# EAGLE design BatteryPowerV2 (EAGLE 9.6.2)
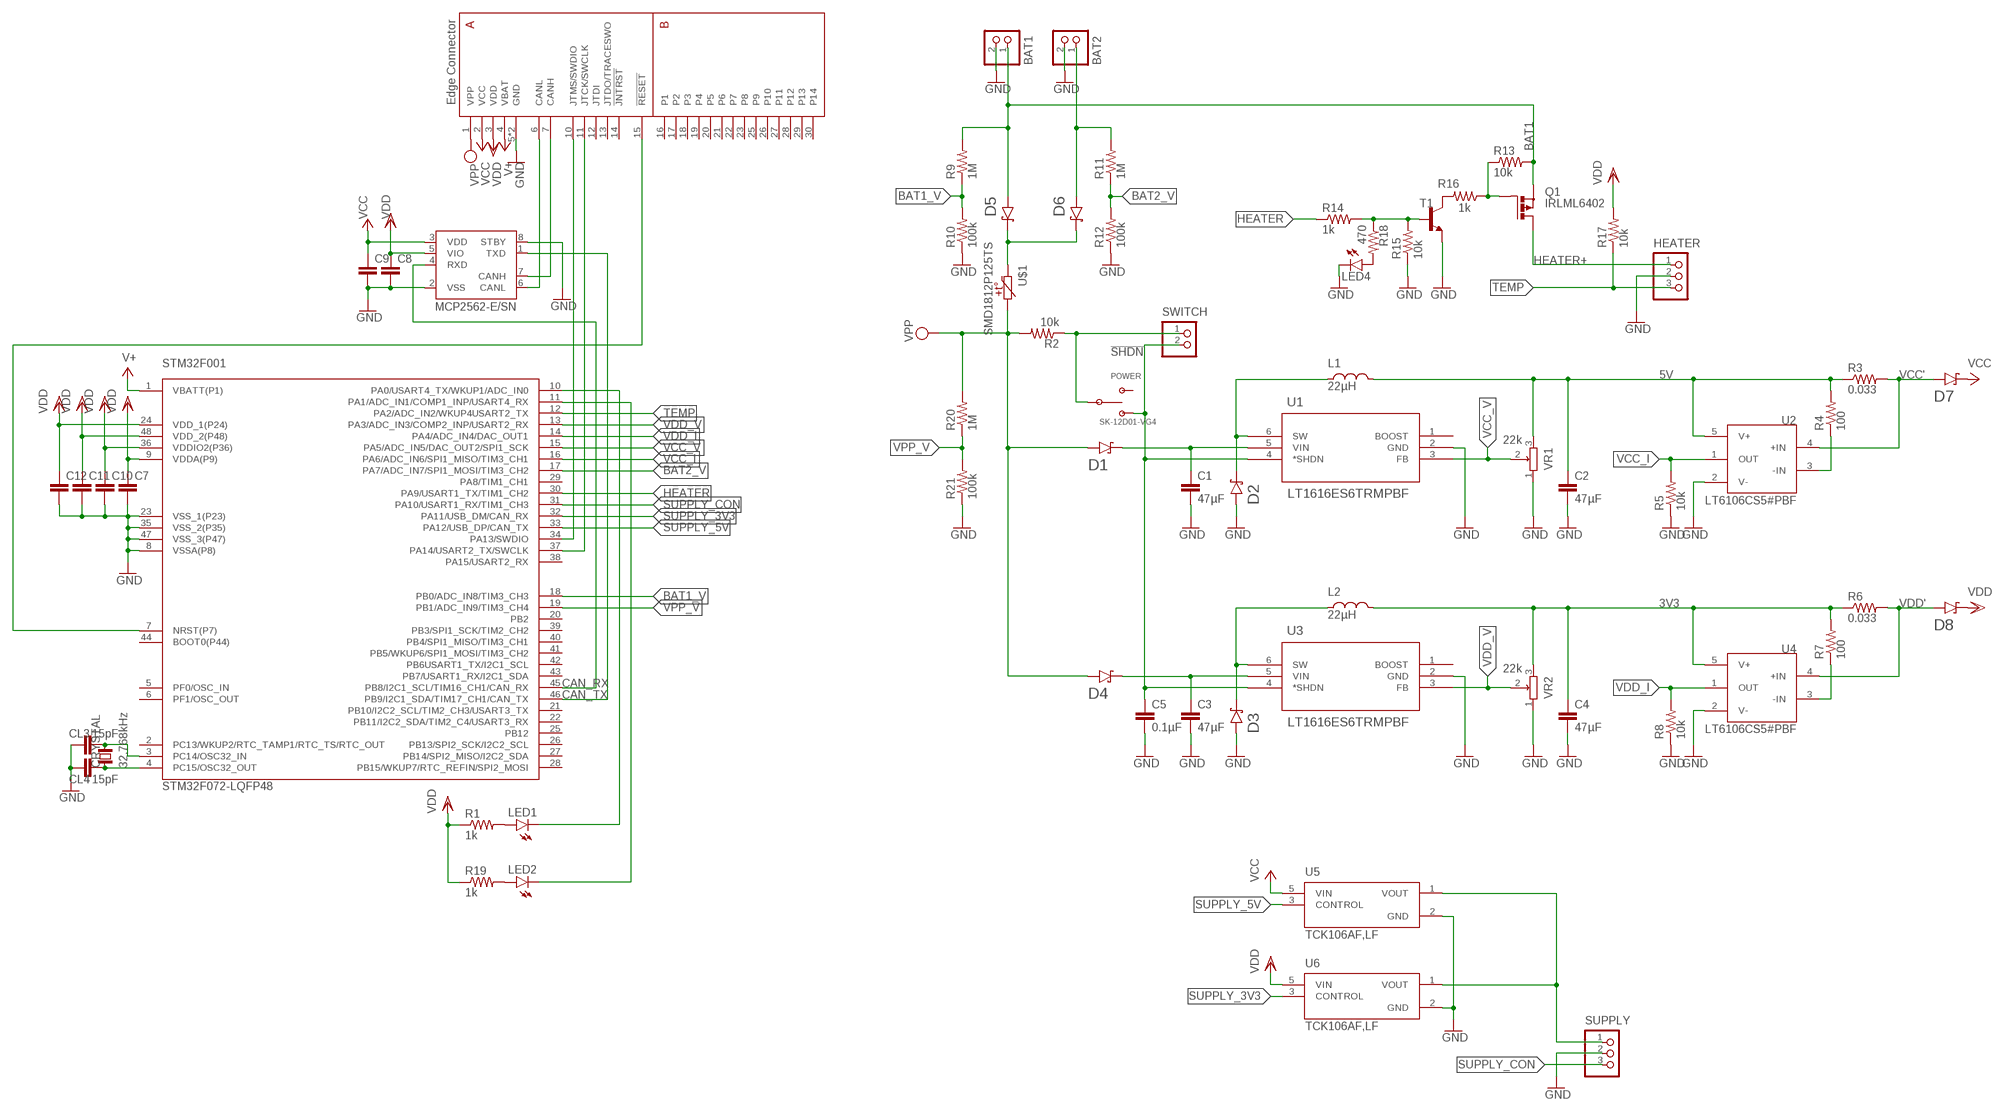
[diagram p0: schematic, sheet 1]

## Parts
BAT1  S2B-XH-A  [S2B-XH-A]
BAT2  S2B-XH-A  [S2B-XH-A]
C1  47µF  C-EUC0603  [C0603]
C2  47µF  C-EUC0603  [C0603]
C3  47µF  C-EUC0603  [C0603]
C4  47µF  C-EUC0603  [C0603]
C5  0.1µF  C-EUC0603  [C0603]
C7  C-EUC0603K  [C0603K]
C8  C-EUC0603K  [C0603K]
C9  C-EUC0603K  [C0603K]
C10  C-EUC0603K  [C0603K]
C11  C-EUC0603K  [C0603K]
C12  C-EUC0603K  [C0603K]
CL3  15pF  C-EUC0603K  [C0603K]
CL4  15pF  C-EUC0603K  [C0603K]
CRYSTAL  32.768kHz  CRYTALFC-255  [FC-255]
D1  CUHS20S30  [CUHS20S30]
D2  CUHS20S30  [CUHS20S30]
D3  CUHS20S30  [CUHS20S30]
D4  CUHS20S30  [CUHS20S30]
D5  CUHS20S30  [CUHS20S30]
D6  CUHS20S30  [CUHS20S30]
D7  CUHS20S30  [CUHS20S30]
D8  CUHS20S30  [CUHS20S30]
HEATER  S3B-PH-K-S  [S3B-PH-K-S]
L1  22µH  NR10050  [NR10050]
L2  22µH  NR10050  [NR10050]
LED1  LEDCHIP-LED0603  [CHIP-LED0603]
LED2  LEDCHIP-LED0603  [CHIP-LED0603]
LED4  LEDCHIPLED_0603  [CHIPLED_0603]
MCP2562  MCP2562-E/SN  [SOIC127P600X175-8N]
POWER  SK-12D01-VG4  [SK-12D01-VG4]
Q1  IRLML6402  [SOT-23]
R1  1k  R-US_R0603  [R0603]
R2  10k  R-US_R0603  [R0603]
R3  0.033  R-US_R0603  [R0603]
R4  100  R-US_R0603  [R0603]
R5  10k  R-US_R0603  [R0603]
R6  0.033  R-US_R0603  [R0603]
R7  100  R-US_R0603  [R0603]
R8  10k  R-US_R0603  [R0603]
R9  1M  R-US_R0603  [R0603]
R10  100k  R-US_R0603  [R0603]
R11  1M  R-US_R0603  [R0603]
R12  100k  R-US_R0603  [R0603]
R13  10k  R-US_R0603  [R0603]
R14  1k  R-US_R0603  [R0603]
R15  10k  R-US_R0603  [R0603]
R16  1k  R-US_R0603  [R0603]
R17  10k  R-US_R0603  [R0603]
R18  470  R-US_R0603  [R0603]
R19  1k  R-US_R0603  [R0603]
R20  1M  R-US_R0603  [R0603]
R21  100k  R-US_R0603  [R0603]
STM32F001  STM32F072-LQFP48  [LQFP48]
SUPPLY  S3B-PH-K-S  [S3B-PH-K-S]
SWITCH  S2B-PH-K-S  [S2B-PH-K-S]
T1  -NPN-SOT23-EBC  [SOT23-EBC]
U1  LT1616ES6TRMPBF  [SOT-6_S]
U2  LT6106CS5#PBF  [SOT95P280X100-5N_LT6106CS5#PBF]
U3  LT1616ES6TRMPBF  [SOT-6_S]
U4  LT6106CS5#PBF  [SOT95P280X100-5N_LT6106CS5#PBF]
U5  TCK106AF,LF  [IC_TCK106AF,LF]
U6  TCK106AF,LF  [IC_TCK106AF,LF]
U$1  SMD1812P125TS  [SMD1812P]
U$2  EDGE30  [EDGE30]
VR1  22k  PVZ3A  [PVZ3A]
VR2  22k  PVZ3A  [PVZ3A]

## Nets
3V3: C4.1 L2.2 R6.1 R7.2 U4.5(V+) VR2.3
5V: C2.1 L1.2 R3.1 R4.2 U2.5(V+) VR1.3
!SHDN!: C5.1 POWER.B SWITCH.2 U1.4(*SHDN) U3.4(*SHDN)
BAT1: BAT1.1 D5.A Q1.P2(S) R9.2 R13.2
BAT1_V: R9.1 R10.2 STM32F001.18(PB0/ADC_IN8/TIM3_CH3)
BAT2: BAT2.1 D6.A R11.2
BAT2_V: R11.1 R12.2 STM32F001.17(PA7/ADC_IN7/SPI1_MOSI/TIM3_CH2)
CAN_RX: MCP2562.4(RXD) STM32F001.45(PB8/I2C1_SCL/TIM16_CH1/CAN_RX)
CAN_TX: MCP2562.1(TXD) STM32F001.46(PB9/I2C1_SDA/TIM17_CH1/CAN_TX)
CANH1: MCP2562.7(CANH) U$2.7(CANH)
CANL1: MCP2562.6(CANL) U$2.6(CANL)
GND: BAT1.2 BAT2.2 C1.2 C2.2 C3.2 C4.2 C5.2 C7.2 C8.2 C9.2 C10.2 C11.2 C12.2 CL3.1 CL4.1 D2.A D3.A HEATER.2 LED4.C MCP2562.2(VSS) MCP2562.8(STBY) R5.1 R8.1 R10.1 R12.1 R15.1 R21.1 STM32F001.8(VSSA(P8)) STM32F001.23(VSS_1(P23)) STM32F001.35(VSS_2(P35)) STM32F001.47(VSS_3(P47)) SUPPLY.2 T1.E U1.2(GND) U2.2(V-) U3.2(GND) U4.2(V-) U5.2(GND) U6.2(GND) U$2.5(GND) U$2.8(GND) VR1.1 VR2.1
HEATER: R14.1 STM32F001.30(PA9/USART1_TX/TIM1_CH2)
HEATER+: HEATER.1 Q1.P3(D)
N$1: SUPPLY.1 U5.1(VOUT) U6.1(VOUT)
N$2: R4.1 U2.3(-IN)
N$3: Q1.P1(G) R13.1 R16.1
N$5: LED2.C STM32F001.11(PA1/ADC_IN1/COMP1_INP/USART4_RX)
N$6: R7.1 U4.3(-IN)
N$7: POWER.C R2.1 SWITCH.1
N$9: LED2.A R19.2
N$10: R14.2 R15.2 R18.1 T1.B
N$11: R16.2 T1.C
N$13: LED4.A R18.2
N$71: CL4.2 CRYSTAL.1 STM32F001.4(PC15/OSC32_OUT)
N$72: CL3.2 CRYSTAL.2 STM32F001.3(PC14/OSC32_IN)
N$73: LED1.C STM32F001.10(PA0/USART4_TX/WKUP1/ADC_IN0)
N$76: LED1.A R1.2
NRST1: STM32F001.7(NRST(P7)) U$2.15(!RESET!)
SUPPLY_3V3: STM32F001.32(PA11/USB_DM/CAN_RX) U6.3(CONTROL)
SUPPLY_5V: STM32F001.33(PA12/USB_DP/CAN_TX) U5.3(CONTROL)
SUPPLY_CON: STM32F001.31(PA10/USART1_RX/TIM1_CH3) SUPPLY.3
SWCLK1: STM32F001.37(PA14/USART2_TX/SWCLK) U$2.11(JTCK/SWCLK)
SWDIO1: STM32F001.34(PA13/SWDIO) U$2.10(JTMS/SWDIO)
TEMP: HEATER.3 R17.1 STM32F001.12(PA2/ADC_IN2/WKUP4USART2_TX)
VBAT: STM32F001.1(VBATT(P1)) U$2.4(VBAT) ; supply symbol labelled V+
VCC: C9.1 D7.C MCP2562.3(VDD) U5.5(VIN) U$2.2(VCC)
VCC': D7.A R3.2 U2.4(+IN)
VCC_I: R5.2 STM32F001.16(PA6/ADC_IN6/SPI1_MISO/TIM3_CH1) U2.1(OUT)
VCC_IN: C1.1 D1.C U1.5(VIN)
VCC_SW: D2.C L1.1 U1.6(SW)
VCC_V: STM32F001.15(PA5/ADC_IN5/DAC_OUT2/SPI1_SCK) U1.3(FB) VR1.2
VDD: C7.1 C8.1 C10.1 C11.1 C12.1 D8.C MCP2562.5(VIO) R1.1 R17.2 R19.1 STM32F001.9(VDDA(P9)) STM32F001.24(VDD_1(P24)) STM32F001.36(VDDIO2(P36)) STM32F001.48(VDD_2(P48)) U6.5(VIN) U$2.3(VDD)
VDD': D8.A R6.2 U4.4(+IN)
VDD_I: R8.2 STM32F001.14(PA4/ADC_IN4/DAC_OUT1) U4.1(OUT)
VDD_IN: C3.1 D4.C U3.5(VIN)
VDD_SW: D3.C L2.1 U3.6(SW)
VDD_V: STM32F001.13(PA3/ADC_IN3/COMP2_INP/USART2_RX) U3.3(FB) VR2.2
VPP: D1.A D4.A R2.2 R20.2 U$1.2 U$2.1(VPP)
VPP_IN: D5.C D6.C U$1.1
VPP_V: R20.1 R21.2 STM32F001.19(PB1/ADC_IN9/TIM3_CH4)
Unconnected: POWER.A STM32F001.2(PC13/WKUP2/RTC_TAMP1/RTC_TS/RTC_OUT) STM32F001.5(PF0/OSC_IN) STM32F001.6(PF1/OSC_OUT) STM32F001.20(PB2) STM32F001.21(PB10/I2C2_SCL/TIM2_CH3/USART3_TX) STM32F001.22(PB11/I2C2_SDA/TIM2_C4/USART3_RX) STM32F001.25(PB12) STM32F001.26(PB13/SPI2_SCK/I2C2_SCL) STM32F001.27(PB14/SPI2_MISO/I2C2_SDA) STM32F001.28(PB15/WKUP7/RTC_REFIN/SPI2_MOSI) STM32F001.29(PA8/TIM1_CH1) STM32F001.38(PA15/USART2_RX) STM32F001.39(PB3/SPI1_SCK/TIM2_CH2) STM32F001.40(PB4/SPI1_MISO/TIM3_CH1) STM32F001.41(PB5/WKUP6/SPI1_MOSI/TIM3_CH2) STM32F001.42(PB6USART1_TX/I2C1_SCL) STM32F001.43(PB7/USART1_RX/I2C1_SDA) STM32F001.44(BOOT0(P44)) U1.1(BOOST) U3.1(BOOST) U$2.12(JTDI) U$2.13(JTDO/TRACESWO) U$2.14(!JNTRST!) U$2.16(P1) U$2.17(P2) U$2.18(P3) U$2.19(P4) U$2.20(P5) U$2.21(P6) U$2.22(P7) U$2.23(P8) U$2.25(P9) U$2.26(P10) U$2.27(P11) U$2.28(P12) U$2.29(P13) U$2.30(P14)

## Library data of the parts
BAT1 BAT2 = con-jst-xh:S2B-XH-A: Wire-to-Board 2.5mm pitch side mount connector Source: http://www.jst-mfg.com/product/pdf/jpn/XH.pdf http://www.jst-mfg.com/product/detail.php?series=277
C1-C5 C7-C12 CL3 CL4 = rcl:C-EU: CAPACITOR, European symbol; SPICEPREFIX: C
CRYSTAL = crystal':CRYTAL: CRYSTAL
D1-D8 = diodes:CUHS20S30
HEATER SUPPLY = jst-ph:S3B-PH-*: Wire-to-Board 2.0mm pitch side mount connector Source: http://www.jst-mfg.com/product/pdf/jpn/PH.pdf http://www.jst-mfg.com/product/detail.php?series=199
L1 L2 = inductors:NR10050
LED1 LED2 LED4 = led:LED: LED OSRAM: - CHIPLED LG R971, LG N971, LY N971, LG Q971, LY Q971, LO R971, LY R971 LH N974, LH R974 LS Q976, LO Q976, LY Q976 LO Q996 - Hyper CHIPLED LW Q18S LB Q993, LB Q99A, LB R99A - SideLED LS A670, LO A670, LY A670, LG A670, LP A670 LB A673, LV A673, LT A673, LW A673 LH A674 LY A675 LS A676, LA A676, LO A676, LY A676, LW A676 LS A679, LY A679, LG A679 - Hyper Micro SIDELED® LS Y876, LA Y876, LO Y876, LY Y876 LT Y87S - SmartLED LW L88C, LW L88S LB L89C, LB L89S, LG L890 LS L89K, LO L89K, LY L89K LS L896, LA L896, LO L896, LY L896 - TOPLED LS T670, LO T670, LY T670, LG T670, LP T670 LSG T670, LSP T670, LSY T670, LOP T670, LYG T670 LG T671, LOG T671, LSG T671 LB T673, LV T673, LT T673, LW T673 LH T674 LS T676, LA T676, LO T676, LY T676, LB T676, LH T676, LSB T676, LW T676 LB T67C, LV T67C, LT T67C, LS T67K, LO T67K, LY T67K, LW E67C LS E67B, LA E67B, LO E67B, LY E67B, LB E67C, LV E67C, LT E67C LW T67C LS T679, LY T679, LG T679 LS T770, LO T770, LY T770, LG T770, LP T770 LB T773, LV T773, LT T773, LW T773 LH T774 LS E675, LA E675, LY E675, LS T675 LS T776, LA T776, LO T776, LY T776, LB T776 LHGB T686 LT T68C, LB T68C - Hyper Mini TOPLED® LB M676 - Mini TOPLED Santana® LG M470 LS M47K, LO M47K, LY M47K Source: http://www.osram.convergy.de LUXEON: - LUMILED® LXK2-PW12-R00, LXK2-PW12-S00, LXK2-PW14-U00, LXK2-PW14-V00 LXK2-PM12-R00, LXK2-PM12-S00, LXK2-PM14-U00 LXK2-PE12-Q00, LXK2-PE12-R00, LXK2-PE12-S00, LXK2-PE14-T00, LXK2-PE14-U00 LXK2-PB12-K00, LXK2-PB12-L00, LXK2-PB12-M00, LXK2-PB14-N00, LXK2-PB14-P00, LXK2-PB14-Q00 LXK2-PR12-L00, LXK2-PR12-M00, LXK2-PR14-Q00, LXK2-PR14-R00 LXK2-PD12-Q00, LXK2-PD12-R00, LXK2-PD12-S00 LXK2-PH12-R00, LXK2-PH12-S00 LXK2-PL12-P00, LXK2-PL12-Q00, LXK2-PL12-R00 Source: www.luxeon.com KINGBRIGHT: KA-3528ASYC Source: www.kingbright.com
MCP2562 = mcp2562-E_SN:MCP2562-E/SN: MCP2562 Series 5 V Surface Mount High-Speed CAN Transceiver - SOIC-8; AVAILABILITY: Unavailable; DESCRIPTION: Microchip MCP2562-E/SN, CAN Transceiver 1MBps 1-channel IEC 61000-4-2, 8-Pin SOIC; MF: Microchip; MP: MCP2562-E/SN; PACKAGE: SO-8 Microchip; PRICE: None
POWER = switches:SK-12D01-VG4
Q1 = mosfet:IRLML6402: Pch MOSFET IRLML6402 20V 3.7A http://akizukidenshi.com/catalog/g/gI-02553/ I-02553
R1-R21 = rcl:R-US_: RESISTOR, American symbol; SPICEPREFIX: R
STM32F001 = stm32f0:STM32F072
SWITCH = jst-ph:S2B-PH-*: Wire-to-Board 2.0mm pitch side mount connector Source: http://www.jst-mfg.com/product/pdf/jpn/PH.pdf http://www.jst-mfg.com/product/detail.php?series=199
T1 = transistor:*-NPN-: NPN Transistror BF959 corrected 2008.03.06
U1 U3 = LT1616ES6TRMPBF:LT1616ES6TRMPBF: Check availability <https://pricing.snapeda.com/parts/LT1616ES6%23TRMPBF/Analog%20Devices/view-part?ref=eda>; AVAILABILITY: In Stock; DESCRIPTION: 600mA, 1.4MHz Step-Down Switching Regulator in SOT-23; MF: Analog Devices; MP: LT1616ES6#TRMPBF; PACKAGE: SOT-6 Analog Devices; PRICE: None; PURCHASE-URL: https://pricing.snapeda.com/search/part/LT1616ES6#TRMPBF/?ref=eda
U2 U4 = LT6106CS5_PBF:LT6106CS5#PBF: IC OPAMP CURR SENSE TSOT23-5 Check availability <https://pricing.snapeda.com/parts/LT6106CS5%23PBF/Linear%20Technology/view-part?ref=eda>; AVAILABILITY: Not in stock; DESCRIPTION: LT6106 - Low Cost, 36V High Side Current Sense Amplifier; MF: Linear Technology; MP: LT6106CS5#PBF; PACKAGE: TSOT-23 Linear Technology; PRICE: None
U5 U6 = TCK106AF_LF:TCK106AF,LF: Power Switch/Driver 1:1 P-Channel 1A 5-SMV, SOT-25, SC-74A Check availability <https://pricing.snapeda.com/parts/TCK106AF%2CLF/Toshiba%20Semiconductor/view-part?ref=eda>; AVAILABILITY: In Stock; DESCRIPTION: Power Switch/Driver 1:1 P-Channel 1A 5-SMV, SOT-25, SC-74A; MF: Toshiba Semiconductor; MP: TCK106AF,LF; PACKAGE: SOT-753 Toshiba Semiconductor; PRICE: None; PURCHASE-URL: https://pricing.snapeda.com/search/part/TCK106AF,LF/?ref=eda
U$1 = ptc:SMD1812P125TS
U$2 = bus:EDGE30
VR1 VR2 = potentiometers:PVZ3A

## Net classes
0 default: width 0.254 mm, drill 0.152 mm, clearance 0.127 mm

## Board
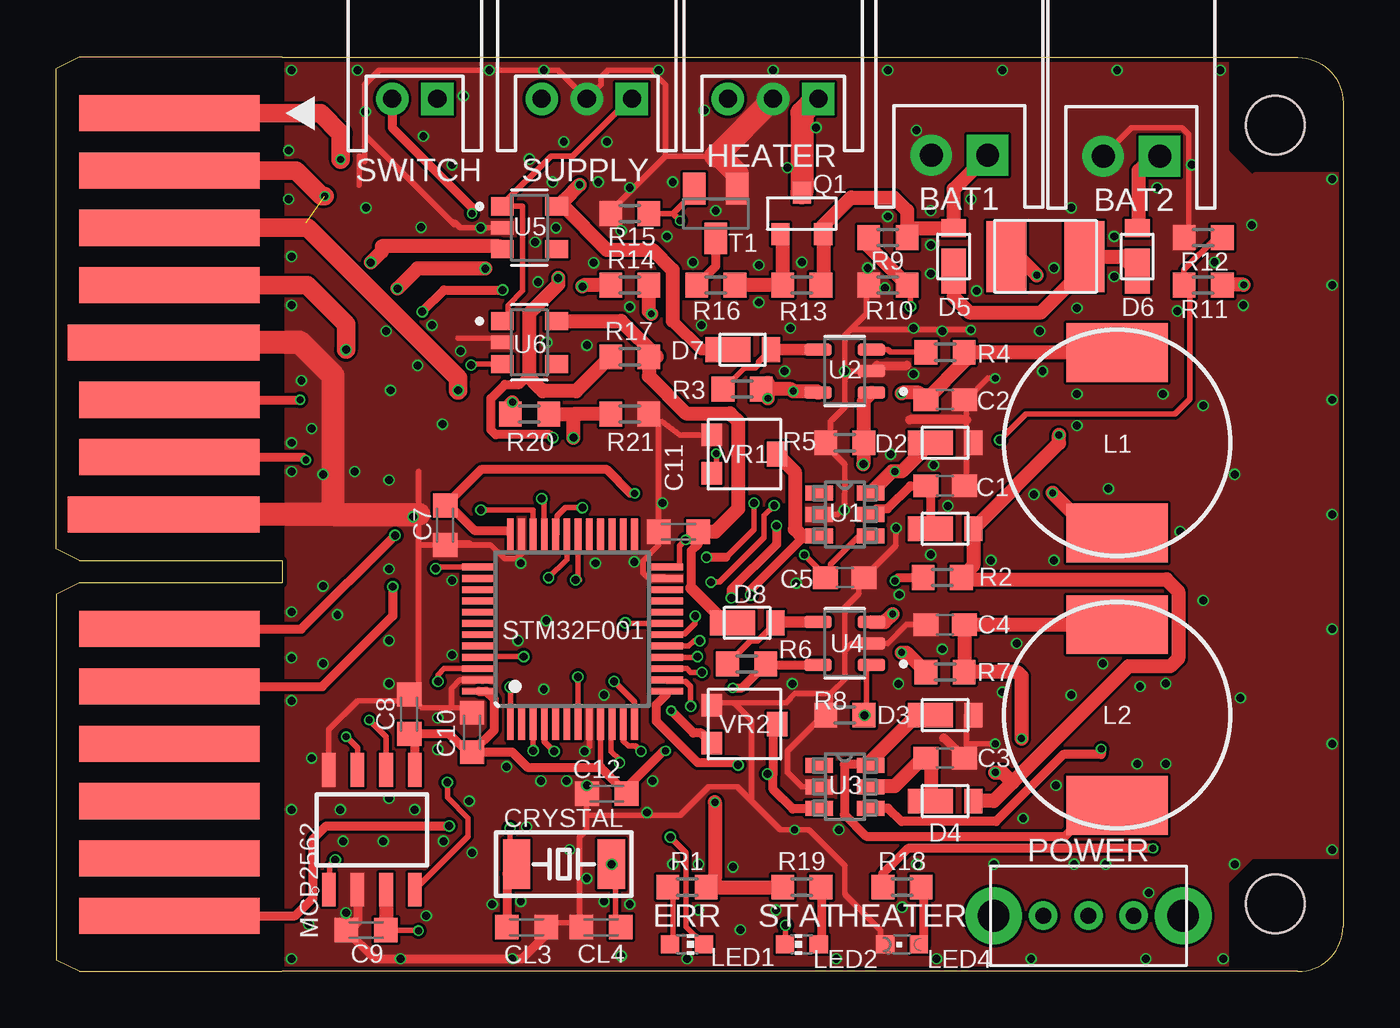
[diagram p1: board, top side]
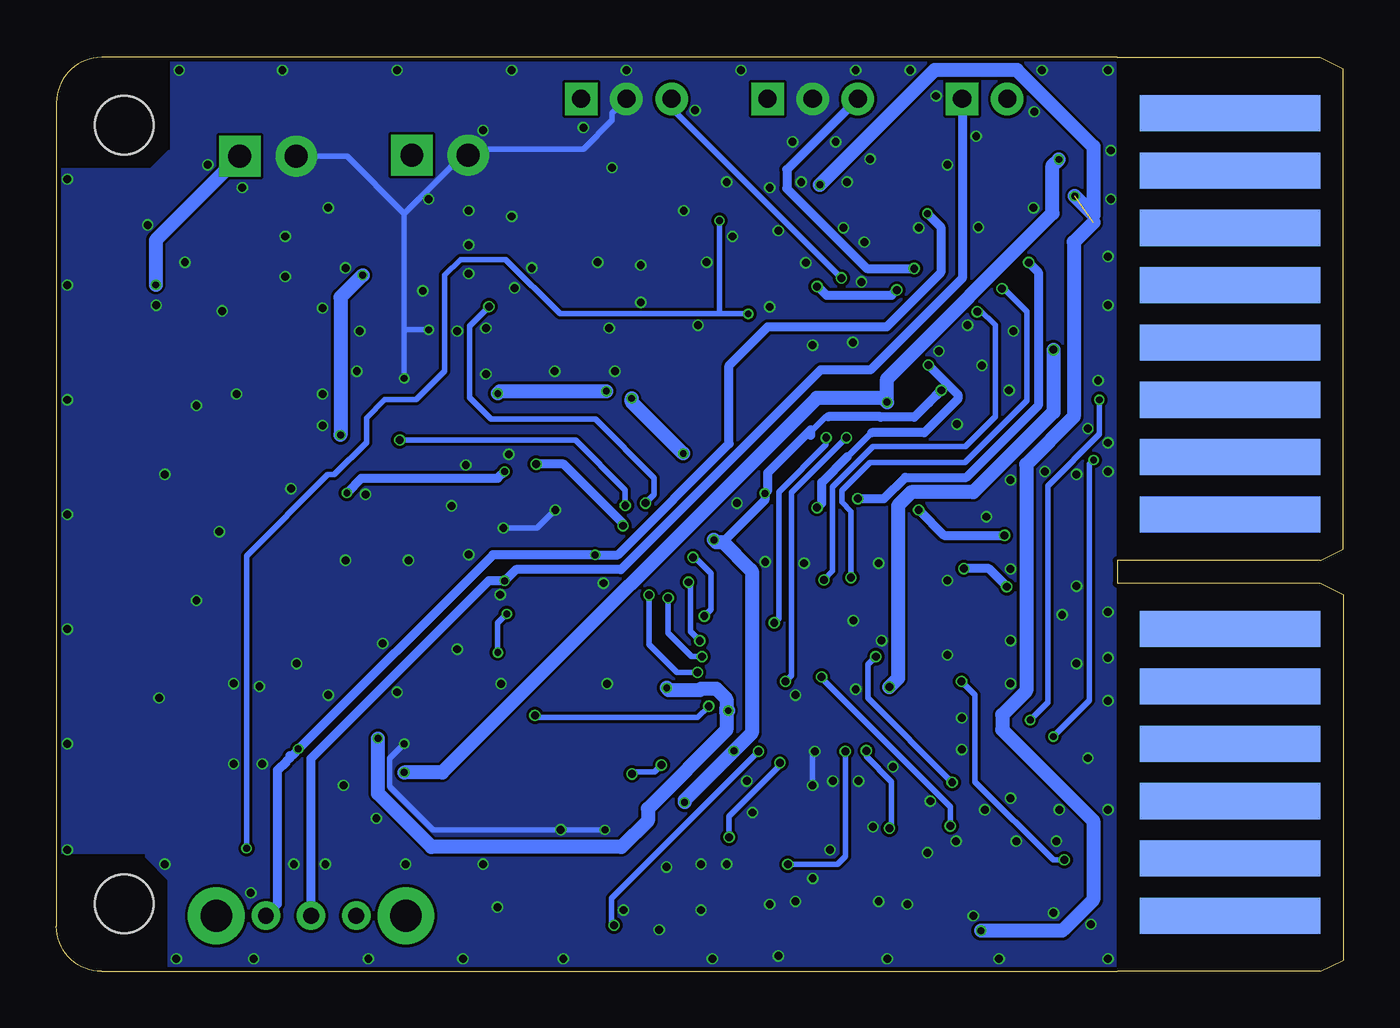
[diagram p2: board, bottom side, seen from below]

Size 57 x 40.5 mm. Coordinates in mm from the lower left corner, seen from the top.
Outline: 10,40.5 55,40.5 arc-90 57,38.5 57,2 arc-90 55,0 10,0
Copper layers (1*16): Top 0.035mm / dielectric 1.6mm / Bottom 0.035mm
Design rules "jlcpcb-2layers_": minimum track width 5mil, minimum drill 0.3mm, track to track 5mil, track to pad 5mil, pad to pad 5mil, via to via 5mil, smd to smd 5mil, copper to edge 0.2mm, drill to drill 6mil, minimum pad ring 10mil, minimum via ring 3mil, stop-mask expansion 4mil, vias tented up to drill 100mil, thermal gap 10mil
Holes 2.6 mm at 54,3 54,37.5

### Footprints (pad centres in the part's own frame; a part is rotated, then mirrored left to right if it is on the bottom)
S2B-XH-A = drill 1.016 square: 1 1.25,0 | drill 1.016: 2 -1.25,0
C0603 = smd 1.1 x 1: 1 -0.85,0; 2 0.85,0
C0603K = smd 1.05 x 1.08: 1 -0.875,0; 2 0.875,0
FC-255 = smd 1.2 x 2.2: 1 -2.1,0; 2 2.1,0
CUHS20S30 = smd 0.8 x 1.1: A 1.25,0 | smd 2 x 1.1: C -0.65,0
S3B-PH-K-S = drill 0.8 square: 1 2,0 | drill 0.8: 2 0,0; 3 -2,0
NR10050 = smd 2.6 x 4.5: 1 -4,0; 2 4,0
CHIP-LED0603 = smd 0.8 x 0.8: A 0,-0.75; C 0,0.75
CHIPLED_0603 = smd 0.8 x 0.8: A 0,-0.75; C 0,0.75
SOIC127P600X175-8N = smd 1.5 x 0.6: 1 -2.65,1.905; 2 -2.65,0.635; 3 -2.65,-0.635; 4 -2.65,-1.905; 5 2.65,-1.905; 6 2.65,-0.635; 7 2.65,0.635; 8 2.65,1.905
SK-12D01-VG4 = drill 1.4 pad 1.93: 1 -4.2,0; 2 4.2,0 | drill 0.7: A -2,0; B 2,0; C 0,0
SOT-23 = smd 0.802 x 0.972: P1 -0.95,-0.917; P2 0.95,-0.917; P3 0,0.917
R0603 = smd 1 x 1.1: 1 -0.85,0; 2 0.85,0
LQFP48 = smd 1.5 x 0.3: 1 -4.15,2.75; 2 -4.15,2.25; 3 -4.15,1.75; 4 -4.15,1.25; 5 -4.15,0.75; 6 -4.15,0.25; 7 -4.15,-0.25; 8 -4.15,-0.75; 9 -4.15,-1.25; 10 -4.15,-1.75; 11 -4.15,-2.25; 12 -4.15,-2.75; 25 4.15,-2.75; 26 4.15,-2.25; 27 4.15,-1.75; 28 4.15,-1.25; 29 4.15,-0.75; 30 4.15,-0.25; 31 4.15,0.25; 32 4.15,0.75; 33 4.15,1.25; 34 4.15,1.75; 35 4.15,2.25; 36 4.15,2.75 | smd 0.3 x 1.5: 13 -2.75,-4.15; 14 -2.25,-4.15; 15 -1.75,-4.15; 16 -1.25,-4.15; 17 -0.75,-4.15; 18 -0.25,-4.15; 19 0.25,-4.15; 20 0.75,-4.15; 21 1.25,-4.15; 22 1.75,-4.15; 23 2.25,-4.15; 24 2.75,-4.15; 37 2.75,4.15; 38 2.25,4.15; 39 1.75,4.15; 40 1.25,4.15; 41 0.75,4.15; 42 0.25,4.15; 43 -0.25,4.15; 44 -0.75,4.15; 45 -1.25,4.15; 46 -1.75,4.15; 47 -2.25,4.15; 48 -2.75,4.15
S2B-PH-K-S = drill 0.8 square: 1 1,0 | drill 0.8: 2 -1,0
SOT23-EBC = smd 1 x 1.4: B 0.95,-1.1; C 0,1.1; E -0.95,-1.1
SOT-6_S = smd 1.219 x 0.66: 1 -1.143,0.95; 2 -1.143,0; 3 -1.143,-0.95; 4 1.143,-0.95; 5 1.143,0; 6 1.143,0.95
SOT95P280X100-5N_LT6106CS5#PBF = smd 1.24 x 0.55: 1 -1.185,0.95; 2 -1.185,0; 3 -1.185,-0.95; 4 1.185,-0.95; 5 1.185,0.95
IC_TCK106AF,LF = smd 1 x 0.8: 1 -1.2,0.95; 3 -1.2,-0.95; 4 1.2,-0.95; 5 1.2,0.95 | smd 1 x 0.6: 2 -1.2,0
SMD1812P = smd 1.78 x 3.15: 1 -1.725,0; 2 1.725,0
EDGE30 = smd 1.6 x 8: 1 -17.78,-5; 2 -15.24,-5; 3 -12.7,-5; 4 -10.16,-5; 6 -5.08,-5; 7 -2.54,-5; 10 5.08,-5; 11 7.62,-5; 12 10.16,-5; 13 12.7,-5; 14 15.24,-5; 15 17.78,-5 | smd 1.6 x 8.5: 5 -7.62,-5.25; 8 0,-5.25 | smd 1.6 x 8 bottom: 16 -17.78,-5; 17 -15.24,-5; 18 -12.7,-5; 19 -10.16,-5; 20 -7.62,-5; 21 -5.08,-5; 22 -2.54,-5; 23 0,-5; 25 5.08,-5; 26 7.62,-5; 27 10.16,-5; 28 12.7,-5; 29 15.24,-5; 30 17.78,-5
PVZ3A = smd 1 x 0.9: 1 -0.85,-1.45; 3 0.85,-1.45 | smd 1.1 x 0.9: 2 0,1.45

### Placement (x,y rotation side)
BAT1  40.01,36.17 0 top
BAT2  47.62,36.12 0 top
C1  39.37,21.52 0 top
C2  39.37,25.33 0 top
C3  39.37,9.46 0 top
C4  39.37,15.37 180 top
C5  34.92,17.46 0 top
C7  17.22,19.77 270 top
C8  15.63,11.41 90 top
C9  13.72,1.84 180 top
C10  18.41,10.6 90 top
C11  27.56,19.49 180 top
C12  24.38,7.88 180 top
CL3  20.83,1.96 180 top
CL4  24.13,1.96 0 top
CRYSTAL  22.48,4.76 180 top
D1  39.37,19.61 0 top
D2  39.37,23.43 0 top
D3  39.37,11.36 0 top
D4  39.37,7.55 0 top
D5  39.75,31.68 90 top
D6  47.88,31.68 90 top
D7  30.4,27.55 0 top
D8  30.6,15.45 0 top
HEATER  31.75,38.66 0 top
L1  46.99,23.43 90 top
L2  46.99,11.36 90 top
LED1  27.94,1.2 270 top
LED2  33.02,1.2 90 top
LED4  37.47,1.2 90 top
MCP2562  13.97,6.28 90 top
POWER  45.72,2.47 0 top
Q1  33.02,33.59 0 top
R1  27.94,3.74 180 top
R2  39.24,17.46 0 top
R3  30.38,25.8 180 top
R4  39.37,27.43 0 top
R5  34.92,23.43 0 top
R6  30.58,13.63 180 top
R7  39.37,13.27 0 top
R8  34.92,11.36 0 top
R9  36.83,32.52 0 top
R10  36.83,30.41 0 top
R11  50.8,30.41 0 top
R12  50.8,32.52 0 top
R13  33.02,30.41 0 top
R14  25.4,30.41 0 top
R15  25.4,33.59 0 top
R16  29.21,30.41 180 top
R17  25.4,27.23 0 top
R18  37.47,3.74 0 top
R19  33.02,3.74 0 top
R20  20.95,24.7 180 top
R21  25.4,24.7 180 top
STM32F001  22.86,15.17 90 top
SUPPLY  23.5,38.66 0 top
SWITCH  15.88,38.66 0 top
T1  29.21,33.59 180 top
U1  34.92,20.25 0 top
U2  34.92,26.6 180 top
U3  34.92,8.19 0 top
U4  34.92,14.54 180 top
U5  20.95,32.95 0 top
U6  20.95,27.87 0 top
U$1  43.81,31.68 180 top
U$2  10,20.25 270 top
VR1  30.48,22.93 270 top
VR2  30.48,10.96 270 top

### Tracks (layer width: path | path; a pad name or v marks a point on that pad's centre or on a via)
3V3  (via drill 0.3)
  Top 0.254: R6.1 31.43,13.58 33.66,13.58 U4.5
  Top 0.406: 33.66,13.58 31.48,13.58 R6.1 30.36,12.57 v29.96,12.57 | VR2.3 28.57,10.57 28.22,10.57 27.24,11.54 v27.24,11.56
  Top 0.61: v42.75,10.33 42.75,13.08 42.56,13.27 R7.2 C4.1 | C4.1 40.32,15.37 | L2.2 C4.1
  Bottom 0.61: v29.96,12.57 29.86,12.46 28.49,12.46 28.43,12.54 27.77,12.54 27.32,12.07 27.32,11.63 v27.24,11.56 27.32,11.48 27.32,10.7 30.8,7.21 30.8,6.69 31.97,5.52 40.39,5.52 42.75,7.88 v42.75,10.33
5V  (via drill 0.3)
  Top 0.254: 40.32,27.23 40.52,27.43 R4.2 | v29.23,22.95 29.23,22.28 VR1.3
  Top 0.61: v31.52,25.39 31.52,26.09 R3.1 32.55,25.8 v32.64,25.71 33.68,25.71 U2.5 | v37.45,25.61 37.48,25.65 38.2,25.65 C2.1 40.32,27.13 | 40.32,27.13 40.32,27.23 40.51,27.43 L1.2 | R4.2 40.22,27.23 40.32,27.13
  Bottom 0.61: v37.45,25.61 37.35,25.71 v32.64,25.71 | v29.23,22.95 31.52,25.23 v31.52,25.39
!SHDN!  (via drill 0.3)
  Top 0.254: U1.4 35.88,19.3 35.56,19.3 34.29,18.03 34.29,17.71 C5.1 34.02,17.59 34.02,17.57 v33.13,18.46
  Top 0.406: U3.4 36.84,7.23 37.44,6.64 41.63,6.64 44.6,9.62 46.28,9.62 v46.28,9.86 | SWITCH.2 14.88,37.39 18.41,33.86 v18.41,33.59
  Bottom 0.254: 46.79,9.34 46.66,9.46 | v46.28,9.86 46.27,9.86 | 46.56,9.56 46.66,9.56
  Bottom 0.406: POWER.B 47.21,2.98 47.21,8.91 46.79,9.34 | 46.56,9.56 46.27,9.86 37.66,18.46 v33.13,18.46 32.12,18.46 27.2,23.38 27.2,26.85 25.48,28.57 20.22,28.57 17.82,30.97 17.82,32.99 v18.41,33.59 | 46.66,9.56 46.66,9.46
BAT1
  Top 0.254: 33.97,30.41 33.9,30.41 R13.2 | 37.58,32.52 R9.2
  Top 0.61: BAT1.1 39.75,34.67 D5.A 38.09,32.93 R9.2 37.68,33.72 37.1,34.3 35.21,34.3 33.97,33.06 Q1.P2 33.97,30.48 33.9,30.41 | 33.97,30.51 R13.2
BAT1_V  (via drill 0.35)
  Top 0.254: STM32F001.18 27.04,14.95 27.84,14.95 28.3,15.41 v28.3,15.75 | 37.84,30.41 v37.84,29.46 | v30.9,20.75 30.9,19.59 29.66,18.35
  Top 0.406: 29.66,18.35 v28.8,18.35
  Top 0.61: R9.1 35.85,32.39 35.85,32.26 37.68,30.43 R10.2 37.84,30.41
  Bottom 0.254: v28.8,18.35 28.76,18.31 28.76,18.39 28,17.63 28,16.05 v28.3,15.75 | v30.9,20.75 30.52,21.14 30.52,21.88 33.12,24.48 37.75,24.48 38.7,25.43 38.7,28.6 v37.84,29.46
BAT2  (via drill 0.3)
  Top 0.61: D6.A 47.94,32.99 47.94,35.49 48.55,36.1 48.85,36.1 BAT2.1 | R11.2 51.66,30.42 v52.6,30.42
  Bottom 0.61: BAT2.1 52.6,32.4 v52.6,30.42
BAT2_V  (via drill 0.35)
  Top 0.254: STM32F001.17 28.01,14.42 28.25,14.66 v28.49,14.66 v28.5,14.65 | v41.79,23.55 42.95,24.7 49.55,24.7 50.2,25.36 50.2,30.16 R11.1 49.95,31.09 51.37,32.52 R12.2 | v29,17.25 29.38,17.25 31.35,19.22 31.35,20.2 v31.8,20.65
  Bottom 0.254: v28.5,14.65 28.91,15.06 28.91,17.16 v29,17.25 | v41.79,23.55 34.01,23.55 31.8,21.34 v31.8,20.65
CAN_RX  (via drill 0.35)
  Top 0.254: v17.32,8.38 17.32,7.71 18.23,6.8 18.23,5.99 MCP2562.4 | STM32F001.45 18.74,13.95 v20.7,13.95
  Bottom 0.254: v20.7,13.95 21.05,13.6 21.05,12.11 v17.32,8.38
CAN_TX  (via drill 0.35)
  Top 0.254: STM32F001.46 17.17,13.42 16.9,13.15 v16.9,12.85 | v12.35,4.95 12.1,4.7 12.1,3.66 MCP2562.1
  Bottom 0.254: v16.9,12.85 16.3,12.25 16.3,8.41 12.84,4.95 v12.35,4.95
CANH1  (via drill 0.3)
  Top 0.254: v12.84,10.41 13.34,9.91 MCP2562.7
  Top 0.406: U$2.7 10.92,22.79 v11.05,22.66
  Bottom 0.254: v12.84,10.41 11.23,12.01 11.23,22.48 v11.05,22.66
CANL1  (via drill 0.3)
  Top 0.254: v13.86,11.14 14.61,10.4 MCP2562.6
  Top 0.406: U$2.6 v10.79,25.33
  Bottom 0.254: v13.86,11.14 13.09,11.91 13.09,21.51 10.79,23.81 v10.79,25.33
GND  (via drill 0.3, 0.35)
  Top 0.254: 26.99,36.12 24.77,33.9 24.77,33.59 R15.1 | 29.4,36.12 29.21,36.12 28.89,36.12 26.99,36.12 | 30.17,35.36 T1.E | 26.99,36.12 26.99,39.3 26.35,39.94 24.45,39.94 24.13,39.62 24.13,39.3 SUPPLY.2 22.23,39.94 14.29,39.94 13.65,39.3 13.65,37.08 | 34.92,26.28 34.92,25.01 34.29,24.38 34.29,23.43 R5.1 33.97,23.43 34.92,22.47 34.92,21.15 | 34.92,26.28 35.24,26.6 U2.2 | 35.17,28.43 34.92,28.19 34.92,26.28 | 35.17,28.43 35.88,29.14 35.88,30.41 R10.1 | U1.2 34.61,20.25 34.92,20.57 34.92,21.15 | R12.1 50.16,32.52 50.16,37.08 49.85,37.39 47.62,37.39 46.35,36.12 BAT2.2 | 40.32,23.43 40.32,21.52 C1.2 | 40.32,23.43 40.32,24.45 40.32,25.33 | 40.32,23.43 D2.A | 40.32,25.33 41.27,26.28 v41.59,26.28 | 40.32,25.33 C2.2 | v40.51,28.43 35.17,28.43 | 34.29,12.31 34.29,11.36 R8.1 33.97,11.36 32.38,9.77 32.38,8.82 33.02,8.19 U3.2 | 34.29,12.31 34.92,12.95 34.92,14.22 | 34.92,14.22 35.24,14.54 U4.2 36.83,14.54 37.66,15.37 C4.2 | 34.92,14.22 34.92,16.12 35.56,16.76 35.56,17.39 C5.2 37.2,18.88 v37.2,19.65 | 23.18,2.15 21.91,2.15 21.8,2.05 CL3.1 21.59,1.84 21.59,1.52 20.64,0.57 | 23.5,6.91 23.5,6.28 23.18,5.96 23.18,2.15 | 23.5,6.91 23.5,7.88 C12.2 23.5,7.89 v23.5,8.25 | 23.18,2.15 CL4.1 | 40.32,10.09 40.32,11.36 D3.A | 40.32,10.09 40.32,9.46 C3.2 | 30.8,7.55 30.16,8.19 28.89,8.19 27.62,6.91 23.5,6.91 | 30.8,7.55 32.07,6.28 v32.7,6.28 33.34,6.28 34.92,4.69 34.92,3.42 36.51,1.84 36.51,1.2 LED4.C | 30.8,7.55 30.8,11.13 30.01,11.91 | VR2.1 29.13,11.91 30.01,11.91 | 30.01,11.91 32.31,11.91 32.72,12.31 34.29,12.31 | v41.59,10.09 40.32,10.09 | 26.67,24.38 26.7,24.38 | 26.7,24.38 26.82,24.38 27.63,23.77 VR1.1 | 26.67,24.38 26.35,24.7 R21.1
  Top 0.254: R21.1 26.67,24.27 26.67,19.61 C11.2 26.68,18.89 25.98,18.19 25.98,17.65 26.14,17.49 26.94,17.49 STM32F001.23 | 26.67,24.38 R21.1 | 13.41,34.83 13.41,36.12 13.65,35.88 13.65,37.08 | U5.2 17.88,32.95 17.63,33.2 17.63,33.1 13.65,37.08 | C8.2 15.56,11.99 13.34,11.99 12.06,10.72 MCP2562.8 | 17.5,11.68 16.19,11.68 15.88,11.99 C8.2 | 17.5,11.68 18.41,11.68 C10.2 | 16.05,18.97 16.05,20.25 16.05,22.15 | C8.2 16.05,12.34 16.05,18.89 C7.2 | 14.2,0.57 14.08,0.57 13.56,1.09 13.56,1.12 12.91,1.76 C9.2 13.34,2.33 MCP2562.2 | R21.1 26.38,24.7 26.7,24.38 | STM32F001.35 20.64,19.29 20.64,18.55 20.38,18.29 19.84,18.29 19.24,18.89 C7.2 | STM32F001.47 17.87,12.92 17.5,12.55 17.5,11.68 | STM32F001.8 23.61,9.96 v23.4,9.75 | C7.2 17.31,18.98 18.3,18.98 | v34.9,20.45 34.9,21.12 34.92,21.15 | U6.2 19.55,28.07 17.8,28.07
  Top 0.406: MCP2562.2 13.34,2.18 12.91,1.76 | C9.2 14.11,0.57 14.2,0.57 20.64,0.57 21.8,1.73 21.8,2.05 | 40.32,24.45 37.8,24.45 | U2.2 36.36,26.85 37.66,26.85 | C3.2 39.33,10.35 39.3,10.35
  Top 1.016: 30.17,35.36 29.4,36.12 | 29.21,36.12 HEATER.2 | 12.26,20.25 U$2.8 | U$2.5 10.79,27.87 12.26,26.41 12.26,20.25 | 12.26,20.25 16.05,20.25
  Bottom 0.254: 41.59,33.59 41.59,28.43 | 41.59,28.43 v41.59,26.28 | 41.59,33.59 39.05,36.12 BAT1.2 38.73,36.44 33.66,36.44 32.38,37.71 32.38,38.03 HEATER.2 | BAT2.2 44.13,36.12 41.59,33.59 | 41.59,28.43 v40.51,28.43 | v41.59,10.09 42.24,9.44 42.24,8.2 40.32,6.28 v32.7,6.28 | v23.4,9.75 23.5,9.65 v23.5,8.25 | v34.9,20.45 35.7,19.65 v37.2,19.65
  other vias: 13.68,38.1 16.16,32.97 17.1,24.25 32.6,12.75 15.8,20.15 10.85,26.18 14.8,25.75 21.7,15.55 44.28,8.25 30.3,1.85 23.5,27.75 25.4,29.45 22.14,32.95 23.8,31.4 37.3,12.75 42.83,6.79 25.6,18.15 26.85,20.75 34.66,6.28 51.56,39.94 46.99,39.94 41.91,39.94 36.83,39.94 31.75,39.94 26.67,39.94 21.59,39.94 19.18,39.94 13.34,39.94 10.41,39.94 10.29,36.38 10.29,34.22 10.41,31.68 10.41,29.52 10.41,23.43 10.41,22.16 11.81,22.03 10.41,15.93 11.81,17.07 10.41,13.9 12.45,15.8 11.81,13.65 10.41,11.99 11.3,9.46 10.41,7.17 10.41,0.57 11.18,2.09 12.83,2.6 12.7,5.77 14.48,5.77 17.14,5.77 16.38,2.47 15.24,0.57 20.19,0.57 19.3,2.98 19.94,9.07 18.29,7.55 15.88,7.17 12.57,7.17 14.73,7.68 16.89,9.84 16.89,11.23 14.73,12.76 17.53,14.03 14.73,14.66 17.53,17.33 14.73,17.84 14.73,21.77 13.21,22.16 11.3,24.06 14.61,28.38 16,26.85 17.91,27.49 16.64,28.63 13.72,33.84 16.26,37.01 18.03,38.79 17.53,35.74 20.95,36 22.48,36.76 21.97,34.98 18.8,32.95 21.34,30.55 21.21,32.31 21.72,27.87 20.57,18.09 23.88,18.09 24.26,12.25 21.59,12.5 20.45,14.66 21.46,8.44 20.57,3.11 24.26,3.11 25.02,0.69 28.45,2.72 31.88,2.72 29.97,4.63 28.45,4.76 26.42,8.44 26.16,7.04 27.3,4.76 25.4,2.98 22.61,8.44 22.73,5.39 23.5,4.12 20.83,6.41 18.41,5.26 37.47,2.85 38.1,4.76 34.54,0.57 27.94,0.57 38.99,0.57 43.18,0.57 48.26,0.57 51.69,0.57 52.2,4.76 48.39,3.49 46.48,4.76 45.09,4.76 41.53,4.76 56.52,5.39 49.15,9.2 47.88,9.2 48.01,12.63 49.15,12.76 46.35,13.65 42.55,14.54 39.24,14.28 41.91,12.38 37.34,16.69 38.73,18.47 32.77,17.2 39.5,20.63 41.4,18.22 43.31,21.14 44.2,18.22 38.86,22.44 36.96,22.92 37.97,26.47 34.92,26.6 32.26,26.6 39.24,28.38 28.57,28.63 32.51,28.51 36.7,30.28 37.97,28.51 35.94,31.17 31.11,29.65 28.19,31.43 31.11,31.3 29.21,33.71 27.05,32.57 25.02,32.82 27.3,34.98 25.4,34.73 24.38,36.76 24,34.98 28.7,38.16 32.38,35.62 33.02,31.43 36.83,33.46 38.73,33.71 33.66,37.39 38.1,37.27 40.51,34.22 40.77,30.16 38.73,30.92 38.73,32.19 43.56,28.38 43.69,26.6 45.21,25.58 49.02,25.58 49.66,29.27 45.21,29.39 46.86,30.79 46.86,32.57 44.2,31.17 44.96,33.84 48.77,34.73 50.29,35.74 56.52,35.11 52.96,33.08 52.58,29.52 51.31,31.43 45.21,24.19 46.61,21.39 49.78,19.49 50.8,25.08 50.8,16.44 44.96,12.25 56.52,10.09 56.52,15.17 56.52,20.25 56.52,25.33 56.52,30.41 52.2,22.03 52.45,12.12
  pour Bottom: 15.11,13.01 15.11,12.88 16.26,11.74
  pour Top (no thermals): 19.68,2.98 19.3,2.6 19.3,2.09
  pour Bottom: 13.08,1.84 13.34,2.09 13.34,2.22
  pour Top (no thermals): 10.15,40.44 10.15,-0.2 10.6,-0.65 51.8,-0.65 51.9,-0.55 51.9,3.95 53,5.05 57.5,5.05 57.5,35.05 57.2,35.35 53.1,35.35 53,35.25 51.9,36.35 51.9,40.95 52.1,41.15 10.5,41.15
  pour Bottom (no thermals): 10.12,0.13 10.8,-0.55 51.7,-0.55 52,-0.25 52,4.05 53,5.05 53,5.25 57.4,5.25 57.5,5.15 57.5,34.95 56.9,35.55 52.82,35.55 52.02,36.35 51.9,36.35 51.9,40.95 52,41.05 10.12,41.05
HEATER  (via drill 0.35)
  Top 0.254: v23,17.35 23.18,17.35 23.11,17.42 STM32F001.30
  Top 0.406: v16.21,29.23 17.17,30.2 v19.77,30.2
  Top 0.61: R14.1 23.36,30.41 v23.3,30.35
  Bottom 0.254: v23,17.35 22.61,17.74 22.61,21.47 20.82,23.26 16.74,23.26 15.41,24.59 15.41,28.64 16.11,29.33 v16.21,29.23
  Bottom 0.406: v19.77,30.2 20,29.97 22.88,29.97 23.27,30.35 v23.3,30.35
HEATER+
  Top 0.254: 33.66,38.66 HEATER.1
  Top 1.016: Q1.P3 33.02,38.03 33.66,38.66
N$1
  Top 0.254: 20,33.9 19.68,33.9 21.91,36.12 22.86,36.12 25.4,38.66 SUPPLY.1 | 20,33.9 20.64,33.9 20.66,33.88 20.66,30.16 20,29.51 20,28.82 U6.1 | 20,33.9 19.88,34.02 U5.1
N$2
  Top 0.254: R4.1 36.95,27.43 36.83,27.55 36.2,27.55 U2.3
N$3
  Top 0.61: Q1.P1 32.17,32.57 R13.1 R16.1
N$5  (via drill 0.35)
  Top 0.254: v25.9,9.75 25.66,9.99 25.34,9.99 25.11,10.22 STM32F001.11 | v32.3,2.05 32.3,1.23 LED2.C
  Bottom 0.254: v25.9,9.75 32.4,3.25 32.4,2.15 v32.3,2.05
N$6  (via drill 0.3)
  Top 0.61: v37.45,14.13 37.66,14.13 R7.1 | U4.3 36.69,15.48 v37.05,15.84
  Bottom 0.254: v37.05,15.84 37.45,15.44 v37.45,14.13
N$7  (via drill 0.3)
  Top 0.406: v37.15,17.31 37.29,17.46 R2.1
  Bottom 0.406: POWER.C 45.72,9.44 37.85,17.31 v37.15,17.31 v37.14,17.31 36.65,17.8 31.99,17.8 23.14,26.65 20.94,26.65 16.88,30.72 SWITCH.1
N$9
  Top 0.254: 33.9,1.2 LED2.A
  Top 0.406: R19.2 33.9,3.71 33.9,1.2
N$10  (via drill 0.3)
  Top 0.254: 27.3,33.59 R15.2 | 27.3,33.59 28.26,34.54 T1.B | v27.62,33.27 27.3,33.59
  Top 0.406: R18.1 36.62,4.34 37.73,5.45 v48.58,5.45
  Top 0.61: v26.35,29.14 26.25,29.24 R14.2
  Bottom 0.254: v26.35,29.14 27.62,29.14 | 27.62,29.14 v27.62,33.27 | 27.62,29.14 34.69,29.14 37.1,31.55 39.1,31.55 39.8,30.85 39.8,26.61 41.07,25.34 42.45,25.34 43.26,24.53 43.26,23.44 44.69,22.02 44.98,22.02 48.58,18.41 v48.58,5.45
N$11
  Top 0.406: R16.2 29.21,31.26 T1.C
N$13
  Top 0.254: 38.42,1.2 LED4.A
  Top 0.406: R18.2 38.42,3.64 38.42,1.2
N$71  (via drill 0.35)
  Top 0.254: CL4.2 24.77,2.15 24.77,4.57 CRYSTAL.1 | STM32F001.4 21.61,10.19 v22.05,9.75 | CRYSTAL.1 24.4,4.94 | CRYSTAL.1 v24.59,4.76 v24.6,4.75
  Bottom 0.254: v22.05,9.75 22.05,5.1 22.4,4.75 v24.6,4.75
N$72  (via drill 0.35)
  Top 0.254: STM32F001.3 21.11,9.79 v21.12,9.78 | v20.1,6.35 20.1,5.04 CRYSTAL.2
  Top 0.406: CRYSTAL.2 19.95,4.33 CL3.2
  Bottom 0.254: v21.12,9.78 21.12,9.53 20,8.41 20,6.45 v20.1,6.35
N$73  (via drill 0.35)
  Top 0.254: LED1.C 27.9,1.99 27.9,5.25 v27.2,5.95 | STM32F001.10 24.58,10.99 24.58,9.75 24.95,9.39 v24.95,9.25
  Bottom 0.254: v24.95,9.25 24.95,9.12 27.2,6.87 v27.2,5.95
N$76
  Top 0.254: LED1.A 27.3,1.2 27.3,3.74 R1.2
NRST1  (via drill 0.35)
  Top 0.254: v23.1,13.05 v23.11,13.04 STM32F001.7
  Top 0.406: U$2.15 10.58,2.47 11.35,3.24 11.35,5.85 11.95,6.45 v17.4,6.45
  Bottom 0.254: v17.4,6.45 17.4,7.3 23.1,13 v23.1,13.05
SUPPLY_3V3  (via drill 0.35)
  Top 0.254: v23.3,20.55 22.55,20.55 22.18,20.19 22.18,19.39 STM32F001.32 | v18.37,26.87 18.37,26.92 U6.3
  Bottom 0.254: 21.95,22.8 20.88,23.87 20.9,23.87 21.96,22.81
  Bottom 0.406: 20.88,23.87 18.55,23.87 17.07,25.36 17.07,25.57 v18.37,26.87 | v23.3,20.55 23.1,20.75 23.1,21.67 21.96,22.81
SUPPLY_5V  (via drill 0.35)
  Top 0.254: v21.5,20.95 21.61,20.84 STM32F001.33
  Top 0.61: v13.93,31.41 14.41,31.89 14.41,32.13 19.62,32.13 U5.3
  Bottom 0.406: v21.5,20.95 20.34,20.95 19.4,21.89 16.69,21.89 13.5,25.09 13.5,30.98 v13.93,31.41
SUPPLY_CON  (via drill 0.35)
  Top 0.254: STM32F001.31 22.61,18.26 v21.8,17.45
  Top 0.61: v15.11,30.26 16,31.15 v19,31.15
  Bottom 0.254: v21.8,17.45 21.8,20.39 22.21,20.8 22.21,21.3 20.95,22.56 16.75,22.56 14.01,25.3 14.01,29.24 15.06,30.3 v15.11,30.26
  Bottom 0.406: SUPPLY.3 24.64,35.53 24.64,34.69 21.1,31.15 v19,31.15
SWCLK1  (via drill 0.35)
  Top 0.254: v16.8,17.85 16.87,17.92 STM32F001.37
  Top 0.406: U$2.11 11.78,12.63 14.9,15.75 v14.9,17.05
  Bottom 0.406: v14.9,17.05 15.7,17.85 v16.8,17.85
SWDIO1  (via drill 0.35)
  Top 0.254: v18.8,20.45 21.11,20.45 STM32F001.34
  Top 0.406: U$2.10 10.85,15.17 v15,19.32
  Bottom 0.406: v15,19.32 17.67,19.32 v18.8,20.45
TEMP  (via drill 0.35)
  Top 0.254: 21.3,25.96 21.27,25.96 21.04,26.19 | 21.04,26.19 20.95,26.28 20.95,26.35 | v24.7,12.85 25.61,11.94 STM32F001.12 | 20.7,26.19 21.04,26.19
  Top 0.406: v22,23.65 21.86,23.79 19.46,23.79 19.25,24 19.25,25.39 19.87,26.01 20.52,26.01 20.7,26.19 | 20.95,26.35 20.95,26.45
  Top 0.61: v22.23,30.73 22.23,30.44 20.95,29.17 20.95,26.45 | R17.1 23.03,25.71 21.55,25.71 21.3,25.96 20.95,26.31 20.95,26.35
  Bottom 0.254: v22.23,30.73 29.53,38.03 29.53,38.66 HEATER.3 | v24.7,12.85 24.43,13.12 24.43,21.22 v22,23.65
VBAT  (via drill 0.35)
  Top 0.254: v20.1,12.6 v20.11,12.59 STM32F001.1
  Top 0.813: U$2.4 11.11,30.41 12.83,28.69 v12.83,27.55
  Bottom 0.61: v12.83,27.55 12.83,24.79 16.38,21.23 19.12,21.23 19.71,20.64 19.71,12.99 v20.1,12.6
VCC  (via drill 0.3)  (1 unrouted)
  Top 0.254: C9.1 16.02,1.84 v16.04,1.81 | 22.49,34.16 22.23,33.9 U5.5
  Top 0.406: 14.61,1.84 C9.1
  Top 0.508: 27.3,28.82 28.58,27.55 D7.C
  Top 0.61: v23.18,34.86 22.49,34.16 | U5.5 22.45,33.9 24.38,31.98 26.4,31.98 27.3,31.08 27.3,28.82 | MCP2562.3 14.61,1.84
  Top 0.813: U$2.2 10.62,35.49 11.76,34.36 v11.89,34.36
  Bottom 0.254: 18,39.94 18.1,39.94 | 12.4,1.85 12.44,1.81
  Bottom 0.61: 11.06,33.19 11.93,32.32 11.93,24.58 14.04,22.47 14.04,12.44 15.1,11.38 15.1,10.71 11.07,6.68 11.07,3.18 12.4,1.85 | 18,39.94 14.45,39.94 11.06,36.55 11.06,33.53 v11.89,34.36 | 18.1,39.94 v23.18,34.86 | 12.44,1.81 v16.04,1.81
VCC'
  Top 0.254: R3.2 30.48,26.75 30.95,26.75 31.1,26.89 31.1,27 D7.A
  Top 0.508: U2.4 D7.A
VCC_I  (via drill 0.35)
  Top 0.254: STM32F001.16 28.37,13.92 v28.4,13.95
  Top 0.406: v31.9,19.75 31.9,18.93 29.89,16.92 v29.89,16.56 v29.9,16.55
  Top 0.61: U2.1 35.77,25.32 R5.2 35.75,23.4 v35.75,22.48
  Bottom 0.254: v28.4,13.95 28.86,13.95 29.9,14.99 v29.9,16.55
  Bottom 0.406: v31.9,19.75 31.9,19.85 34.53,22.48 v35.75,22.48
VCC_IN
  Top 0.254: 38.4,21.52 C1.1
  Top 0.406: U1.5 36.33,20.51 36.83,20.51 37.83,21.52 38.4,21.52 | C1.1 38.72,21.32 D1.C
VCC_SW  (via drill 0.3)
  Top 0.406: v37.15,22.16 37.45,22.16
  Top 0.61: U1.6 37.02,22.16 37.45,22.16 D2.C | v44.13,21.2 45.91,19.42 L1.1
  Bottom 0.406: v37.15,22.16 37.45,21.86 43.48,21.86 v44.13,21.2
VCC_V  (via drill 0.35)
  Top 0.254: 32.93,19.38 33.02,19.3 33.15,19.3 33.66,19.3 U1.3 | STM32F001.15 27.93,13.42 28.1,13.25 v28.6,13.25
  Top 0.406: v30.75,16.68 30.75,16.9 33.15,19.3
  Top 0.61: VR1.2 32.72,22.14 32.72,19.6 32.93,19.38 | 33.02,19.3 U1.3
  Bottom 0.254: v30.75,16.68 30.75,14.5 29.5,13.25 v28.6,13.25
VDD  (via drill 0.3, 0.35)
  Top 0.254: 25.08,7.88 C12.1 25.26,8.14 | 26.61,27.23 R17.2 | 28.57,19.61 C11.1 | 17.42,20.64 C7.1 | C11.1 28.43,19.34 | C11.1 28.23,19.49 v27.88,19.13 27.6,18.86 27.6,17.92 STM32F001.24 | STM32F001.9 24.11,9.06 | STM32F001.36 19.91,19.52
  Top 0.406: C11.1 28.43,18.95 28.12,18.63 28.12,16.99 | 25.26,8.14 26.89,9.77 v26.99,9.77 | C10.1 18.21,9.72 17.4,10.53 C8.1 15.88,10.28 MCP2562.5 | C10.1 19.4,10.71 19.4,12.06 19.04,12.41 STM32F001.48 | STM32F001.48 | C10.1 20.19,9.72 20.86,9.05 24.1,9.05 24.11,9.06 24.11,9.03 C12.1 | v25.62,21.18 25.43,21.18 24.38,22.23 18.81,22.23 C7.1 | 19.91,19.52 18.55,19.52 17.42,20.64 | STM32F001.48
  Top 0.508: 28.12,16.99 29.65,15.45 D8.C
  Top 0.61: U6.5 25.02,28.82 26.61,27.23 | 26.39,27.04 26.25,27.17 R17.2 26.25,26.37 27.89,24.73 29.84,24.73 30.21,24.36 30.21,20.51 29.19,19.49 C11.1 | v29.18,7.5 29.18,4.12 R1.1 R19.1
  Top 0.813: U$2.3 11.13,32.95 17.8,26.29 v17.8,25.75
  Bottom 0.254: 26.19,17.74 26.25,17.8 | 22.8,24.59 22.92,24.59 23.58,23.92 | 23.58,24 23.58,23.92 | 23.58,23.92 23.58,23.75
  Bottom 0.406: 17.83,25.73 18.35,25.2 | 18.35,25.2 18.99,24.57 20.48,24.57 20.5,24.59 22.8,24.59 | 23.58,23.75 23.58,24.01 | 23.58,24 25.48,22.1 25.48,21.32 v25.62,21.18 25.62,20.89 27.48,19.03 | v17.8,25.75 18.35,25.2
  Bottom 0.61: v29.18,7.5 29.18,7.59 v26.99,9.77 26.19,10.57 26.19,17.74 | 26.25,17.8 27.48,19.03 27.77,19.03 v27.88,19.13
VDD'
  Top 0.254: 33.66,15.49 U4.4 | R6.2 30.74,14.65 31.05,14.65 31.2,14.79 31.2,14.8 D8.A
  Top 0.508: D8.A 31.89,15.48 U4.4
VDD_I  (via drill 0.35)
  Top 0.254: U4.1 35.88,13.58 35.88,11.46 R8.2 v35.79,11.36 v35.8,11.35 | STM32F001.14 27.08,12.85 27.88,12.85 28.1,12.62 v28.1,11.75
  Bottom 0.254: v28.1,11.75 28.6,11.25 35.7,11.25 v35.8,11.35
VDD_IN
  Top 0.254: 38.73,7.55 D4.C
  Top 0.61: U3.5 36.1,8.22 37.14,8.22 38.21,9.29 38.36,9.29 C3.1 38.73,9.24 38.73,7.55
VDD_SW
  Top 0.406: L2.1 46.04,7.36 44.68,5.99 35.87,5.99 34.9,6.96 34.9,9.17 36.03,9.17 U3.6
  Top 0.61: U3.6 36.07,9.31 38.12,11.36 D3.C
VDD_V  (via drill 0.35)
  Top 0.254: STM32F001.13 27.01,12.26
  Top 0.406: VR2.2 31.75,10.78 31.75,8.75 | v31.5,8.75 31.75,8.75 | U3.3 33.75,7.2 32.62,7.2 31.75,8.07 31.75,8.75 | v30.2,9.15 30.1,9.25 28.42,9.25 26.58,11.09 26.58,11.83 27.01,12.26 27.01,12.37
  Bottom 0.254: v30.2,9.15 30.5,8.85 31.4,8.85 v31.5,8.75
VPP  (via drill 0.3)
  Top 0.254: 40.1,17.47 R2.2
  Top 0.61: R2.2 40.18,17.37 49.17,17.37 49.7,16.85 49.7,13.87 49.35,13.52 47.5,13.52 42.35,8.38 | 42.35,8.38 41.53,7.55 D4.A | v41.59,8.82 41.91,8.82 42.35,8.38 | v44.41,23.77 44.41,23.41 D1.A 40.62,17.98 40.1,17.47 | U$1.2 42.61,31.68 v43.43,30.85 | R20.2 20.11,25.13 v20.2,25.23
  Top 0.813: U$2.1 11.7,38.03 12.59,37.13 v12.59,35.98
  Bottom 0.61: v41.59,8.82 39.91,8.82 23.32,25.41 20.39,25.41 v20.2,25.23 20.2,26.25 12.87,33.59 12.87,35.71 v12.59,35.98 | v43.43,30.85 44.41,29.87 v44.41,23.77
VPP_IN
  Top 0.254: 45.4,31.05 45.4,31.68 45.5,31.68 | 45.4,30.55 45.4,31.05 | 45.4,31.05 U$1.1
  Top 0.61: D6.C 47.23,31.68 U$1.1 45.6,31.74 45.6,32.25 45.5,32.15 45.5,31.68 | D5.C 39.75,29.89 40.44,29.2 43.62,29.2 44.97,30.55 45.4,30.55
VPP_V  (via drill 0.35)
  Top 0.254: STM32F001.19 25.23,15.42 v25.2,15.45
  Top 0.61: R20.1 22.9,24.7 | R21.2 22.9,24.7 | v22.9,23.65 22.9,24.7
  Bottom 0.254: v22.9,23.65 22.9,23.35 25,21.25 25,15.65 v25.2,15.45

### Text on the board
tNames: POWER | ERR | STAT | HEATER
tStop: WASA Rocket 2023
bStop: Battery Power Module Ver.2